# EAGLE design Secure_ESP8266 (EAGLE 9.3.0)
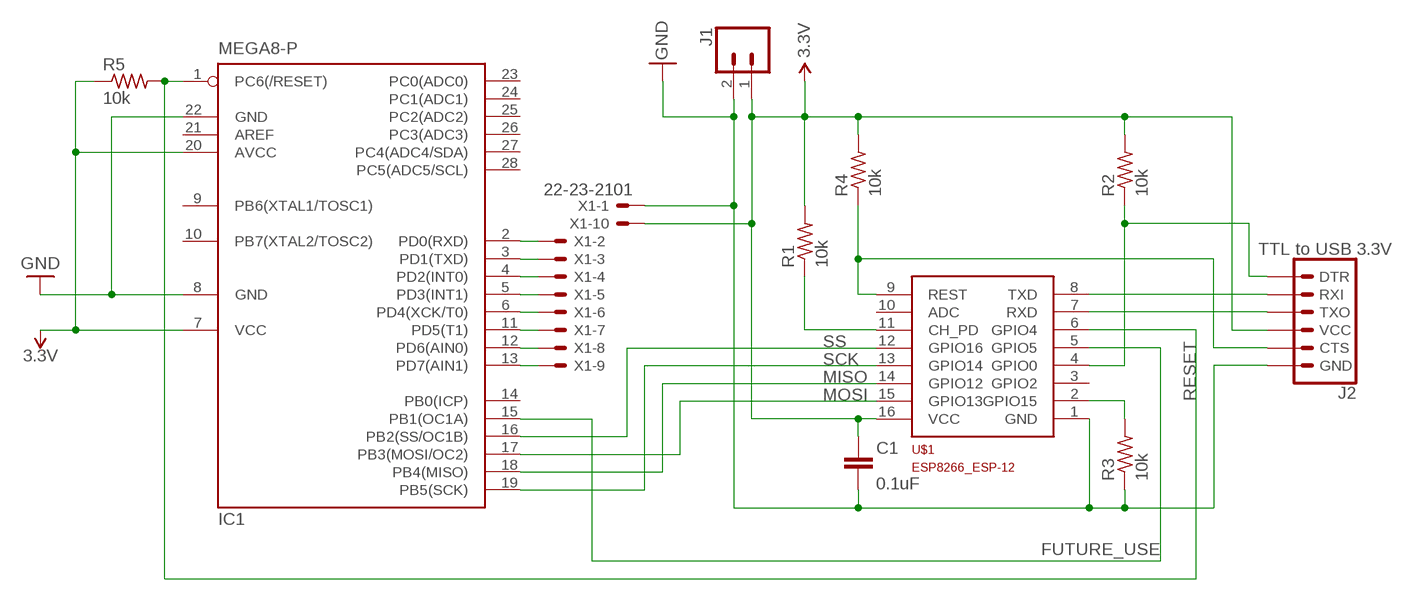
[diagram p0: schematic, sheet 1]

## Parts
C1  0.1uF  0.1UF-KIT-EZ-50V-20%  [CAP-PTH-SMALL-KIT]
IC1  MEGA8-P  [DIL28-3]
J1  CONN_02PTH3  [1X02_LONGPADS]
J2  TTL to USB 3.3V  6_PIN_SERIAL_TARGETLONGPADS  [1X06_LONGPADS]
R1  10k  R-US_0204/7  [0204/7]
R2  10k  R-US_0204/7  [0204/7]
R3  10k  R-US_0204/7  [0204/7]
R4  10k  R-US_0204/7  [0204/7]
R5  10k  R-US_0204/7  [0204/7]
U$1  ESP8266_ESP-12  [ESP8266-ESP12]
X1  22-23-2101  [22-23-2101]

## Nets
3.3V: C1.2 IC1.7(VCC) IC1.20(AVCC) J1.1 J2.4(VCC) R1.2 R2.2 R4.2 R5.1 U$1.16(VCC) X1.10
D0: IC1.2(PD0(RXD)) X1.2
D1: IC1.3(PD1(TXD)) X1.3
D2: IC1.4(PD2(INT0)) X1.4
D3: IC1.5(PD3(INT1)) X1.5
D4: IC1.6(PD4(XCK/T0)) X1.6
D5: IC1.11(PD5(T1)) X1.7
D6: IC1.12(PD6(AIN0)) X1.8
D7: IC1.13(PD7(AIN1)) X1.9
FUTURE_USE: IC1.15(PB1(OC1A)) U$1.5(GPIO5)
GND: C1.1 IC1.8(GND) IC1.22(GND) J1.2 J2.6(GND) R3.1 U$1.1(GND) X1.1
MISO: IC1.18(PB4(MISO)) U$1.14(GPIO12)
MOSI: IC1.17(PB3(MOSI/OC2)) U$1.15(GPIO13)
N$1: J2.5(CTS) R4.1 U$1.9(REST)
N$2: R1.1 U$1.11(CH_PD)
N$3: R3.2 U$1.2(GPIO15)
N$4: J2.1(DTR) R2.1 U$1.4(GPIO0)
N$5: J2.2(RXI) U$1.8(TXD)
N$6: J2.3(TXO) U$1.7(RXD)
RESET: IC1.1(PC6(/RESET)) R5.2 U$1.6(GPIO4)
SCK: IC1.19(PB5(SCK)) U$1.13(GPIO14)
SS: IC1.16(PB2(SS/OC1B)) U$1.12(GPIO16)
Unconnected: IC1.9(PB6(XTAL1/TOSC1)) IC1.10(PB7(XTAL2/TOSC2)) IC1.14(PB0(ICP)) IC1.21(AREF) IC1.23(PC0(ADC0)) IC1.24(PC1(ADC1)) IC1.25(PC2(ADC2)) IC1.26(PC3(ADC3)) IC1.27(PC4(ADC4/SDA)) IC1.28(PC5(ADC5/SCL)) U$1.3(GPIO2) U$1.10(ADC)

## Library data of the parts
C1 = SparkFun-Capacitors:0.1UF: 0.1µF ceramic capacitors A capacitor is a passive two-terminal electrical component used to store electrical energy temporarily in an electric field.; PROD_ID: CAP-08370
IC1 = atmel:MEGA8-P: MICROCONTROLLER 8 Kbytes FLASH, 1 kbytes SRAM, 512 bytes EEPROM, USART, 4-channel 10 bit ADC, 2-channel 8 bit ADC Pin compatible with Atmega48, ATMega88, ATMega168 Source: avr.lbr; OC_FARNELL: unknown; OC_NEWARK: unknown
J1 = SparkFun-Connectors:CONN_02: Multi connection point. Often used as Generic Header-pin footprint for 0.1 inch spaced/style header connections On any of the 0.1 inch spaced packages, you can populate with these: Break Away Headers - Straight <https://www.sparkfun.com/products/116> (PRT-00116) Break Away Male Headers - Right Angle <https://www.sparkfun.com/products/553> (PRT-00553) Female Headers <https://www.sparkfun.com/products/115> (PRT-00115) Break Away Headers - Machine Pin <https://www.sparkfun.com/products/117> (PRT-00117) Break Away Female Headers - Swiss Machine Pin <https://www.sparkfun.com/products/743> (PRT-00743) For SCREWTERMINALS and SPRING TERMINALS visit here: Screw Terimnals on SparkFun.com <https://www.sparkfun.com/search/results?term=Screw+Terminals> (5mm/3.5mm/2.54mm spacing) This device is also useful as a general connection point to wire up your design to another part of your project. Our various solder wires solder well into these plated through hole pads. Hook-Up Wire - Assortment (Stranded, 22 AWG) <https://www.sparkfun.com/products/11375> (PRT-11375) Hook-Up Wire - Assortment (Solid Core, 22 AWG) <https://www.sparkfun.com/products/11367> (PRT-11367) View the entire wire category on our website here <https://www.sparkfun.com/categories/141> Special notes: Molex polarized connector foot print use with: PRT-08233 with associated crimp pins and housings. 2.54_SCREWTERM for use with PRT-10571. 3.5mm Screw Terminal footprints for PRT-08084 5mm Screw Terminal footprints for use with PRT-08432
J2 = SparkFun-Connectors:6_PIN_SERIAL_TARGET: 6-pin header connection for use with the "FTDI BASIC" pinout - TARGET SIDE. Also known as "Arduino Serial Program Header". It is used to mate with our FTDI Basic serial programmers using the Arduino IDE. Note, this device has "TARGET" in the name. It is intended to be used on a design that contains a target micro-controller that you wish to program. The "sister" device, named "CABLE" is inteneded to be used on a design that usually lives on the end of your USB cable and prvides the converter chip (FTDI232 or FTDI231x) to commnicate serial RX/TX. You can populate with some of these: Break Away Headers - Straight <https://www.sparkfun.com/products/116> (PRT-00116) For reference (or to suit your programming needs) check out these designs: SparkFun FTDI Basic Breakout - 5V <https://www.sparkfun.com/products/9716> (DEV-09716) SparkFun FTDI Basic Breakout - 3.3V <https://www.sparkfun.com/products/9873> (DEV-09873) SparkFun FTDI SmartBasic <https://www.sparkfun.com/products/12935> (DEV-12935) SparkFun Beefy 3 - FTDI Basic Breakout <https://www.sparkfun.com/products/13746> (DEV-13746)
R1-R5 = resistor:R-US_: RESISTOR, American symbol
U$1 = ESP8266-ESP12:ESP8266_ESP-12
X1 = con-molex:22-23-2101: .100" (2.54mm) Center Header - 10 Pin; MF: MOLEX; MPN: 22-23-2101; OC_FARNELL: 1756828; OC_NEWARK: 94C0765

## Board
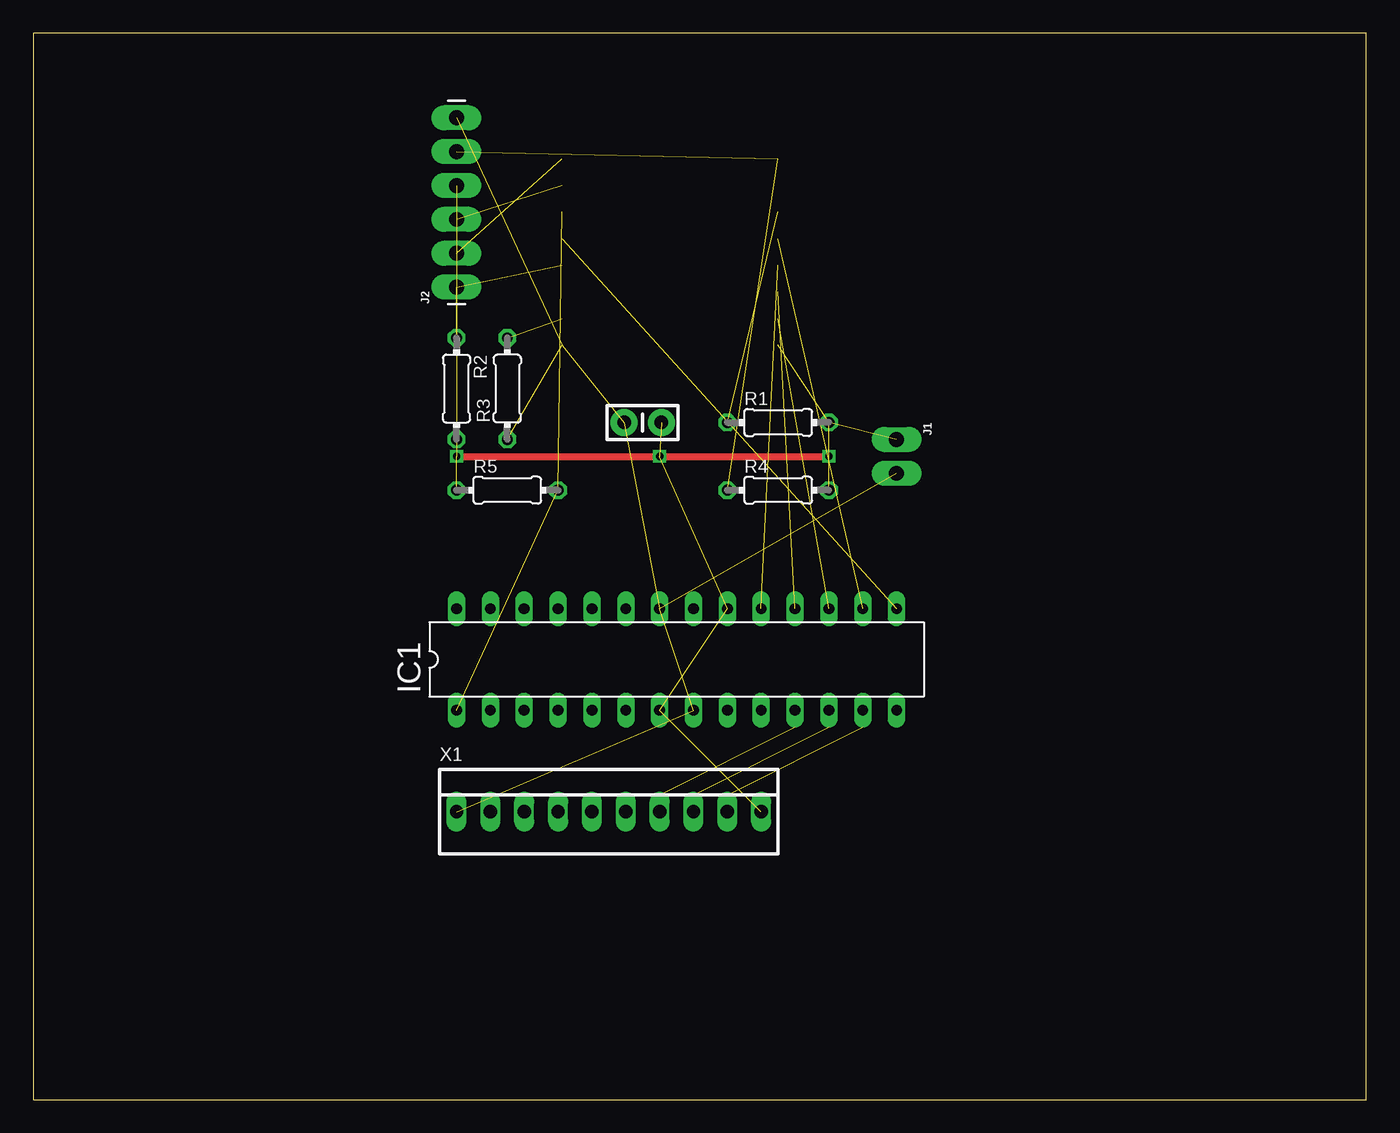
[diagram p1: board, top side]
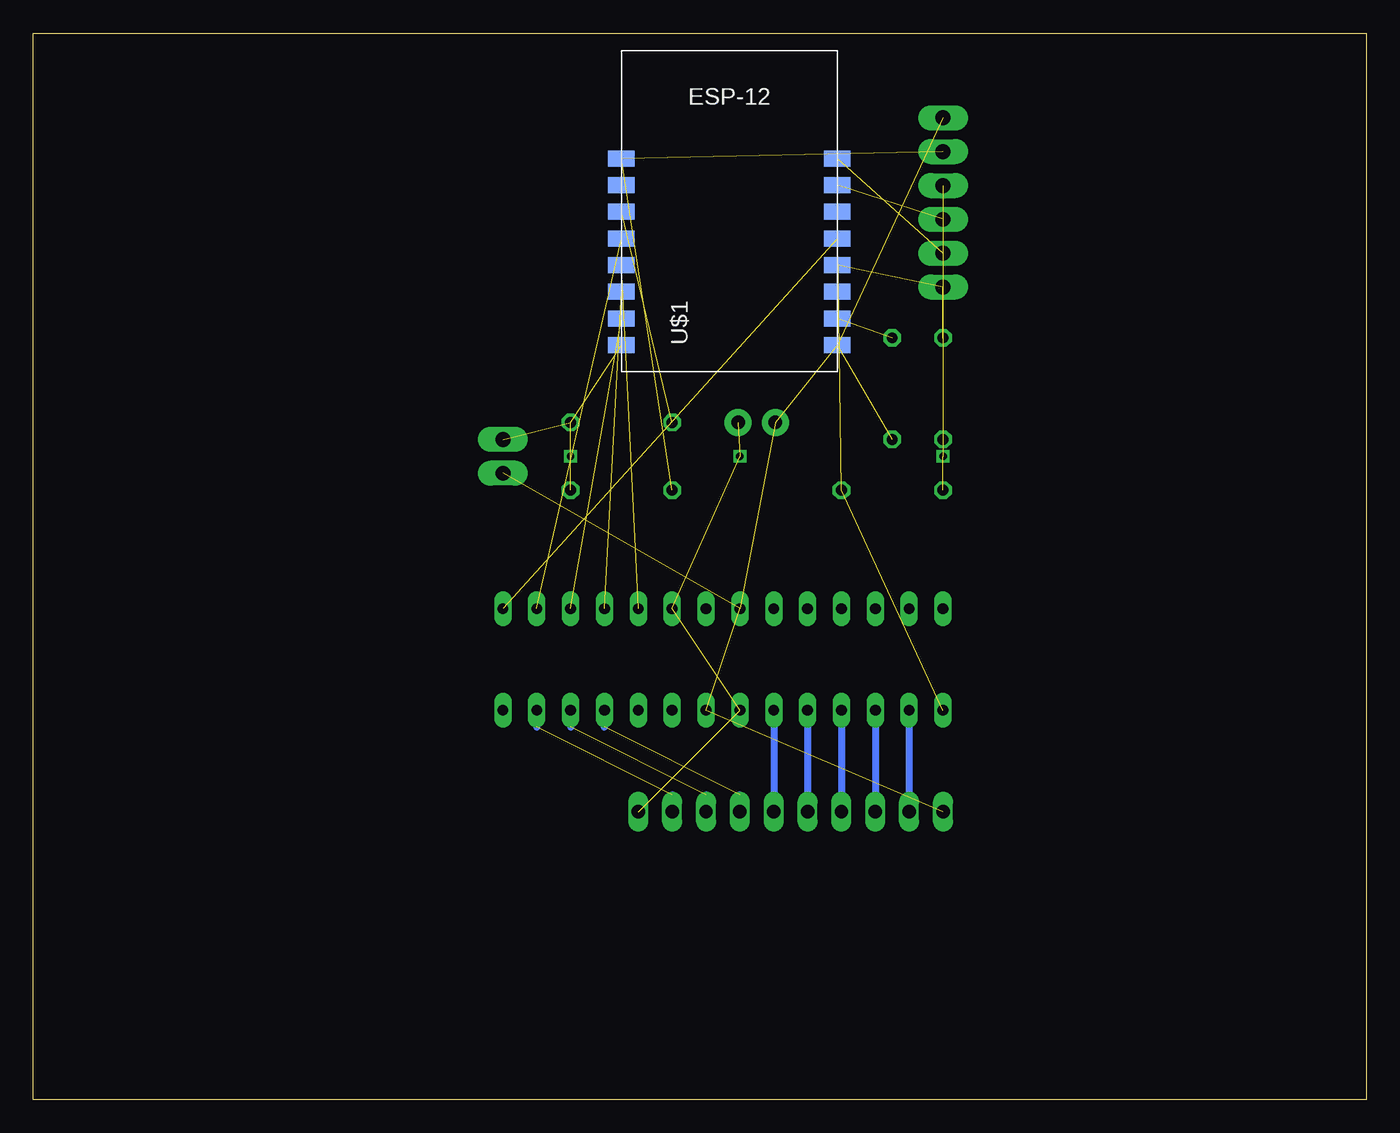
[diagram p2: board, bottom side, seen from below]

Size 100 x 80 mm. Coordinates in mm from the lower left corner, seen from the top.
Outline: 0,0 100,0 100,80 0,80 0,0
Copper layers (1*16): Top 0.035mm / dielectric 1.5mm / Bottom 0.035mm
Design rules "default *": minimum track width 12mil, minimum drill 0.35mm, track to track 14mil, track to pad 14mil, pad to pad 6mil, via to via 6mil, smd to smd 6mil, copper to edge 40mil, drill to drill 6mil, minimum pad ring 10mil, minimum via ring 8mil, stop-mask expansion 4mil, vias tented up to drill 0mil, thermal gap 10mil

### Footprints (pad centres in the part's own frame; a part is rotated, then mirrored left to right if it is on the bottom)
CAP-PTH-SMALL-KIT = drill 1.016 pad 2.032: 1 -1.397,0; 2 1.397,0
DIL28-3 = drill 0.813 long: 1 -16.51,-3.81; 2 -13.97,-3.81; 3 -11.43,-3.81; 4 -8.89,-3.81; 5 -6.35,-3.81; 6 -3.81,-3.81; 7 -1.27,-3.81; 8 1.27,-3.81; 9 3.81,-3.81; 10 6.35,-3.81; 11 8.89,-3.81; 12 11.43,-3.81; 13 13.97,-3.81; 14 16.51,-3.81; 15 16.51,3.81; 16 13.97,3.81; 17 11.43,3.81; 18 8.89,3.81; 19 6.35,3.81; 20 3.81,3.81; 21 1.27,3.81; 22 -1.27,3.81; 23 -3.81,3.81; 24 -6.35,3.81; 25 -8.89,3.81; 26 -11.43,3.81; 27 -13.97,3.81; 28 -16.51,3.81
1X02_LONGPADS = drill 1.118 pad 1.88 long: 1 0,0; 2 2.54,0
1X06_LONGPADS = drill 1.118 pad 1.88 long: 1 0,0; 2 2.54,0; 3 5.08,0; 4 7.62,0; 5 10.16,0; 6 12.7,0
0204/7 = drill 0.813 octagon: 1 -3.81,0; 2 3.81,0
ESP8266-ESP12 = smd 2 x 1.2: 1 16.2,2; 2 16.2,4; 3 16.2,6; 4 16.2,8; 5 16.2,10; 6 16.2,12; 7 16.2,14; 8 16.2,16; 9 0,16; 10 0,14; 11 0,12; 12 0,10; 13 0,8; 14 0,6; 15 0,4; 16 0,2
22-23-2101 = drill 1 long: 1 -11.43,0; 2 -8.89,0; 3 -6.35,0; 4 -3.81,0; 5 -1.27,0; 6 1.27,0; 7 3.81,0; 8 6.35,0; 9 8.89,0; 10 11.43,0

### Placement (x,y rotation side)
C1  45.72,50.8 0 top
IC1  48.26,33.02 0 top
J1  64.77,49.53 270 top
J2  31.75,60.96 90 top
R1  55.88,50.8 0 top
R2  31.75,53.34 270 top
R3  35.56,53.34 90 top
R4  55.88,45.72 0 top
R5  35.56,45.72 0 top
U$1  55.88,54.61 0 bottom
X1  43.18,21.59 0 top

### Tracks (layer width: path | path; a pad name or v marks a point on that pad's centre or on a via)
3.3V  (via drill 0.55, 0.55 pad 0.8)  (11 unrouted)
  Top 0.508: v31.75,48.26 v46.99,48.26 v59.69,48.26
D0
  Bottom 0.508: IC1.2 X1.2
D1
  Bottom 0.508: IC1.3 X1.3
D2
  Bottom 0.508: IC1.4 X1.4
D3
  Bottom 0.508: IC1.5 X1.5
D4
  Bottom 0.508: IC1.6 X1.6
D5  (1 unrouted)
  Bottom 0.508: X1.7 46.99,22.86 | IC1.11 57.15,27.94
D6  (1 unrouted)
  Bottom 0.508: X1.8 49.53,22.86 | IC1.12 59.69,27.94
D7  (1 unrouted)
  Bottom 0.508: X1.9 52.07,22.86 | IC1.13 62.23,27.94
FUTURE_USE  (1 unrouted)
GND  (7 unrouted)
MISO  (1 unrouted)
MOSI  (1 unrouted)
N$1  (2 unrouted)
N$2  (1 unrouted)
N$3  (1 unrouted)
N$4  (2 unrouted)
N$5  (1 unrouted)
N$6  (1 unrouted)
RESET  (2 unrouted)
SCK  (1 unrouted)
SS  (1 unrouted)